# Altium schematic sheet Measure&Select.SchDoc
size A4
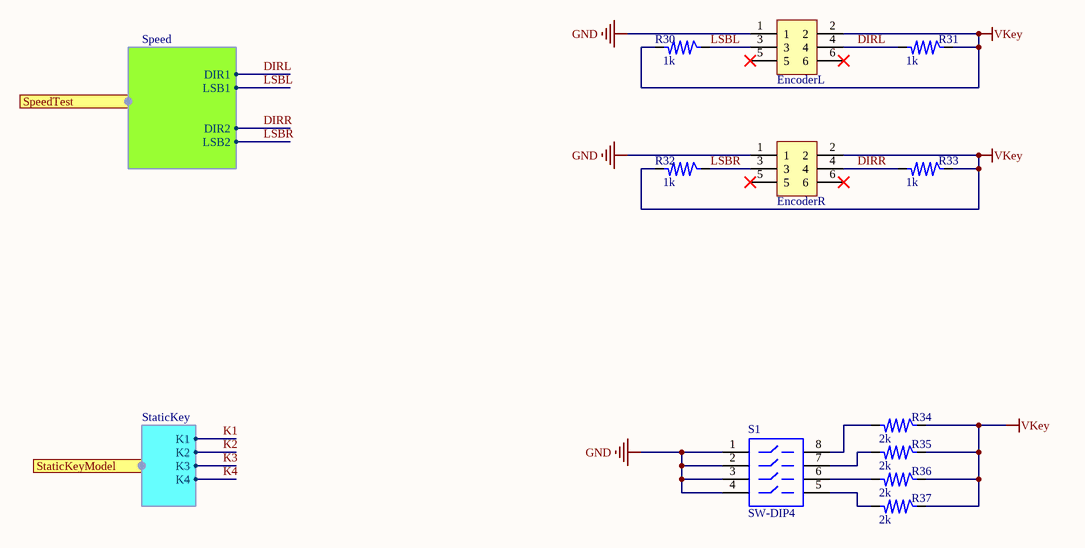
[diagram p0: Measure&Select.SchDoc]

## Parts
EncoderL  编码器  [编码器]  (value not drawn)
EncoderR  编码器  [编码器]  (value not drawn)
R30  1k  [R0603]
R31  1k  [R0603]
R32  1k  [R0603]
R33  1k  [R0603]
R34  2k  [R0603]
R35  2k  [R0603]
R36  2k  [R0603]
R37  2k  [R0603]
S1  SW-DIP4  [SW-DIP4]

## Ports
SpeedTest (harness Speed), StaticKeyModel (harness StaticKey)

## Harnesses
Speed: DIR1, LSB1, LSB2, DIR2
StaticKey: K1, K2, K3, K4

## Nets
GND: EncoderL.1 EncoderR.1 S1.1 S1.2 S1.3 S1.4
VKey: EncoderL.2 EncoderR.2 R30.1 R31.2 R32.1 R33.2 R34.2 R35.2 R36.2 R37.2
DIRL: EncoderL.4 R31.1 ; port SpeedTest.DIR1
DIRR: EncoderR.4 R33.1 ; port SpeedTest.DIR2
K1: port StaticKeyModel.K1
K2: port StaticKeyModel.K2
K3: port StaticKeyModel.K3
K4: port StaticKeyModel.K4
LSBL: EncoderL.3 R30.2 ; port SpeedTest.LSB1
LSBR: EncoderR.3 R32.2 ; port SpeedTest.LSB2
NetR34_1: R34.1 S1.8
NetR35_1: R35.1 S1.7
NetR36_1: R36.1 S1.6
NetR37_1: R37.1 S1.5

Not connected (* = marked no-connect by the designer): EncoderL 5* 6*; EncoderR 5* 6*

## Library data of the parts
R30-R37 = Resistor: 电阻